# EAGLE design Circuit (EAGLE 8.7.1)
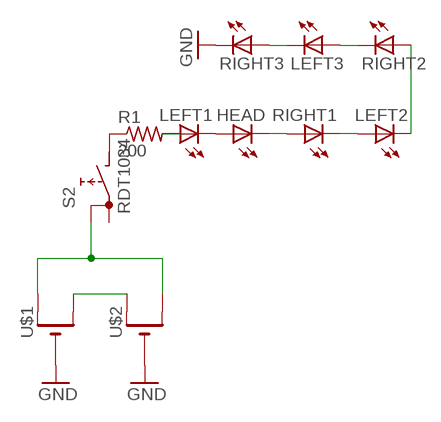
[diagram p0: schematic, sheet 1]

## Parts
HEAD  LED3MM  [LED3MM]
LEFT1  LED3MM  [LED3MM]
LEFT2  LED3MM  [LED3MM]
LEFT3  LED3MM  [LED3MM]
R1  200  R-US_0204/2V  [0204V]
RIGHT1  LED3MM  [LED3MM]
RIGHT2  LED3MM  [LED3MM]
RIGHT3  LED3MM  [LED3MM]
S2  RDT1034  [RDT1034]
U$1  CR1220THM  [CR1220-THM]
U$2  CR1220THM  [CR1220-THM]

## Nets
GND: RIGHT3.K(C) U$1.- U$2.-
N$1: U$1.+2(+1) U$2.+1(+)
N$2: S2.A U$1.+1(+) U$2.+2(+1)
N$3: LEFT1.A R1.2
N$4: HEAD.A LEFT1.K(C)
N$5: HEAD.K(C) RIGHT1.A
N$6: LEFT2.A RIGHT1.K(C)
N$7: LEFT3.A RIGHT2.K(C)
N$8: LEFT2.K(C) RIGHT2.A
N$9: LEFT3.K(C) RIGHT3.A
N$10: R1.1 S2.B
Unconnected: S2.A1

## Library data of the parts
HEAD LEFT1-LEFT3 RIGHT1-RIGHT3 = adafruit:LED: LED OSRAM: - CHIPLED LG R971, LG N971, LY N971, LG Q971, LY Q971, LO R971, LY R971 LH N974, LH R974 LS Q976, LO Q976, LY Q976 LO Q996 - Hyper CHIPLED LW Q18S LB Q993, LB Q99A, LB R99A - SideLED LS A670, LO A670, LY A670, LG A670, LP A670 LB A673, LV A673, LT A673, LW A673 LH A674 LY A675 LS A676, LA A676, LO A676, LY A676, LW A676 LS A679, LY A679, LG A679 - Hyper Micro SIDELED® LS Y876, LA Y876, LO Y876, LY Y876 LT Y87S - SmartLED LW L88C, LW L88S LB L89C, LB L89S, LG L890 LS L89K, LO L89K, LY L89K LS L896, LA L896, LO L896, LY L896 - TOPLED LS T670, LO T670, LY T670, LG T670, LP T670 LSG T670, LSP T670, LSY T670, LOP T670, LYG T670 LG T671, LOG T671, LSG T671 LB T673, LV T673, LT T673, LW T673 LH T674 LS T676, LA T676, LO T676, LY T676, LB T676, LH T676, LSB T676, LW T676 LB T67C, LV T67C, LT T67C, LS T67K, LO T67K, LY T67K, LW E67C LS E67B, LA E67B, LO E67B, LY E67B, LB E67C, LV E67C, LT E67C LW T67C LS T679, LY T679, LG T679 LS T770, LO T770, LY T770, LG T770, LP T770 LB T773, LV T773, LT T773, LW T773 LH T774 LS E675, LA E675, LY E675, LS T675 LS T776, LA T776, LO T776, LY T776, LB T776 LHGB T686 LT T68C, LB T68C - Hyper Mini TOPLED® LB M676 - Mini TOPLED Santana® LG M470 LS M47K, LO M47K, LY M47K Source: http://www.osram.convergy.de/
R1 = adafruit:R-US_: RESISTOR, American symbol
S2 = switch:RDT1034: PUSH SWITCH www.radiohm.com
U$1 U$2 = adafruit:CR1220: CR1216/CR1220/CR1225 12mm 3V lithium coin cell Great for battery packup. Both SMT and THM holders. Note the THM package has the ground pads on both sides of the PCB so that the masks are the same - this reduces the cost

## Board
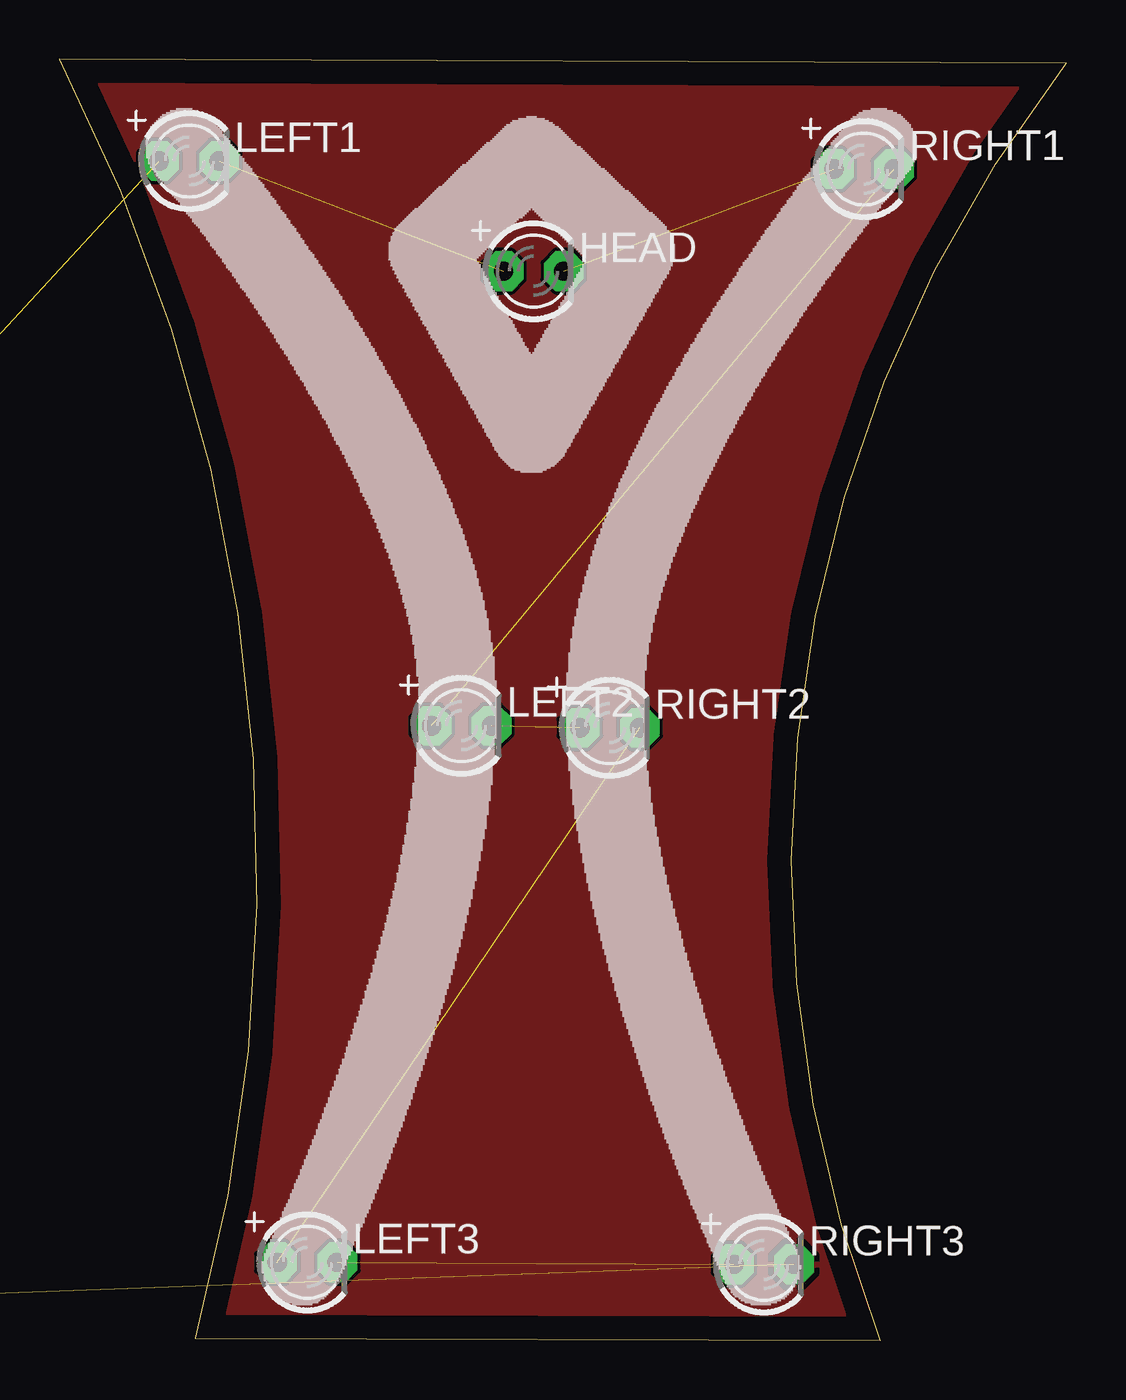
[diagram p1: board, top side]

Size 42.6 x 54.18 mm. Coordinates in mm from the lower left corner, seen from the top.
Outline: 5.76,0.08 34.72,0 arc-59 42.6,54.01 0,54.18 arc-42 5.76,0.08
Copper layers (1*16): Top 0.035mm / dielectric 1.5mm / Bottom 0.035mm
Design rules "default": minimum track width 6mil, minimum drill 0.35mm, track to track 6mil, track to pad 6mil, pad to pad 6mil, via to via 6mil, smd to smd 6mil, copper to edge 40mil, drill to drill 6mil, minimum pad ring 10mil, minimum via ring 8mil, stop-mask expansion 4mil, vias tented up to drill 0mil, thermal gap 10mil

### Footprints (pad centres in the part's own frame; a part is rotated, then mirrored left to right if it is on the bottom)
LED3MM = drill 0.813 pad 1.676 octagon: A -1.27,0; K 1.27,0
0204V = drill 0.813 octagon: 1 -1.27,0; 2 1.27,0
RDT1034 = drill 0.8: A 3.175,-0.635; A1 -3.175,0.635; B 0.65,1.9
CR1220-THM = drill 2 pad 3.175: +1 -6.604,0; +2 6.604,0 | drill 0.8 pad 3.962 square: - 0,0

### Placement (x,y rotation side)
HEAD  20.07,45.21 0 top
LEFT1  5.5,49.87 0 top
LEFT2  17.02,25.99 0 top
LEFT3  10.5,3.3 0 top
R1  -7.87,38.1 0 top  (outside the outline)
RIGHT1  34.04,49.53 0 top
RIGHT2  23.28,25.91 0 top
RIGHT3  29.8,3.22 0 top
S2  -9.14,27.94 180 top  (outside the outline)
U$1  -21.84,1.27 180 top  (outside the outline)
U$2  -23.11,55.88 0 top  (outside the outline)

### Tracks (layer width: path | path; a pad name or v marks a point on that pad's centre or on a via)
GND  (1 unrouted)
  pour Top: -35.81,72.39 69.6,72.39 69.6,-11.43 -42.16,-15.24
N$1  (1 unrouted)
N$2  (2 unrouted)
N$3  (1 unrouted)
N$4  (1 unrouted)
N$5  (1 unrouted)
N$6  (1 unrouted)
N$7  (1 unrouted)
N$8  (1 unrouted)
N$9  (1 unrouted)
N$10  (1 unrouted)